# EAGLE design lnrc_basico_edu (EAGLE 7.1.0)
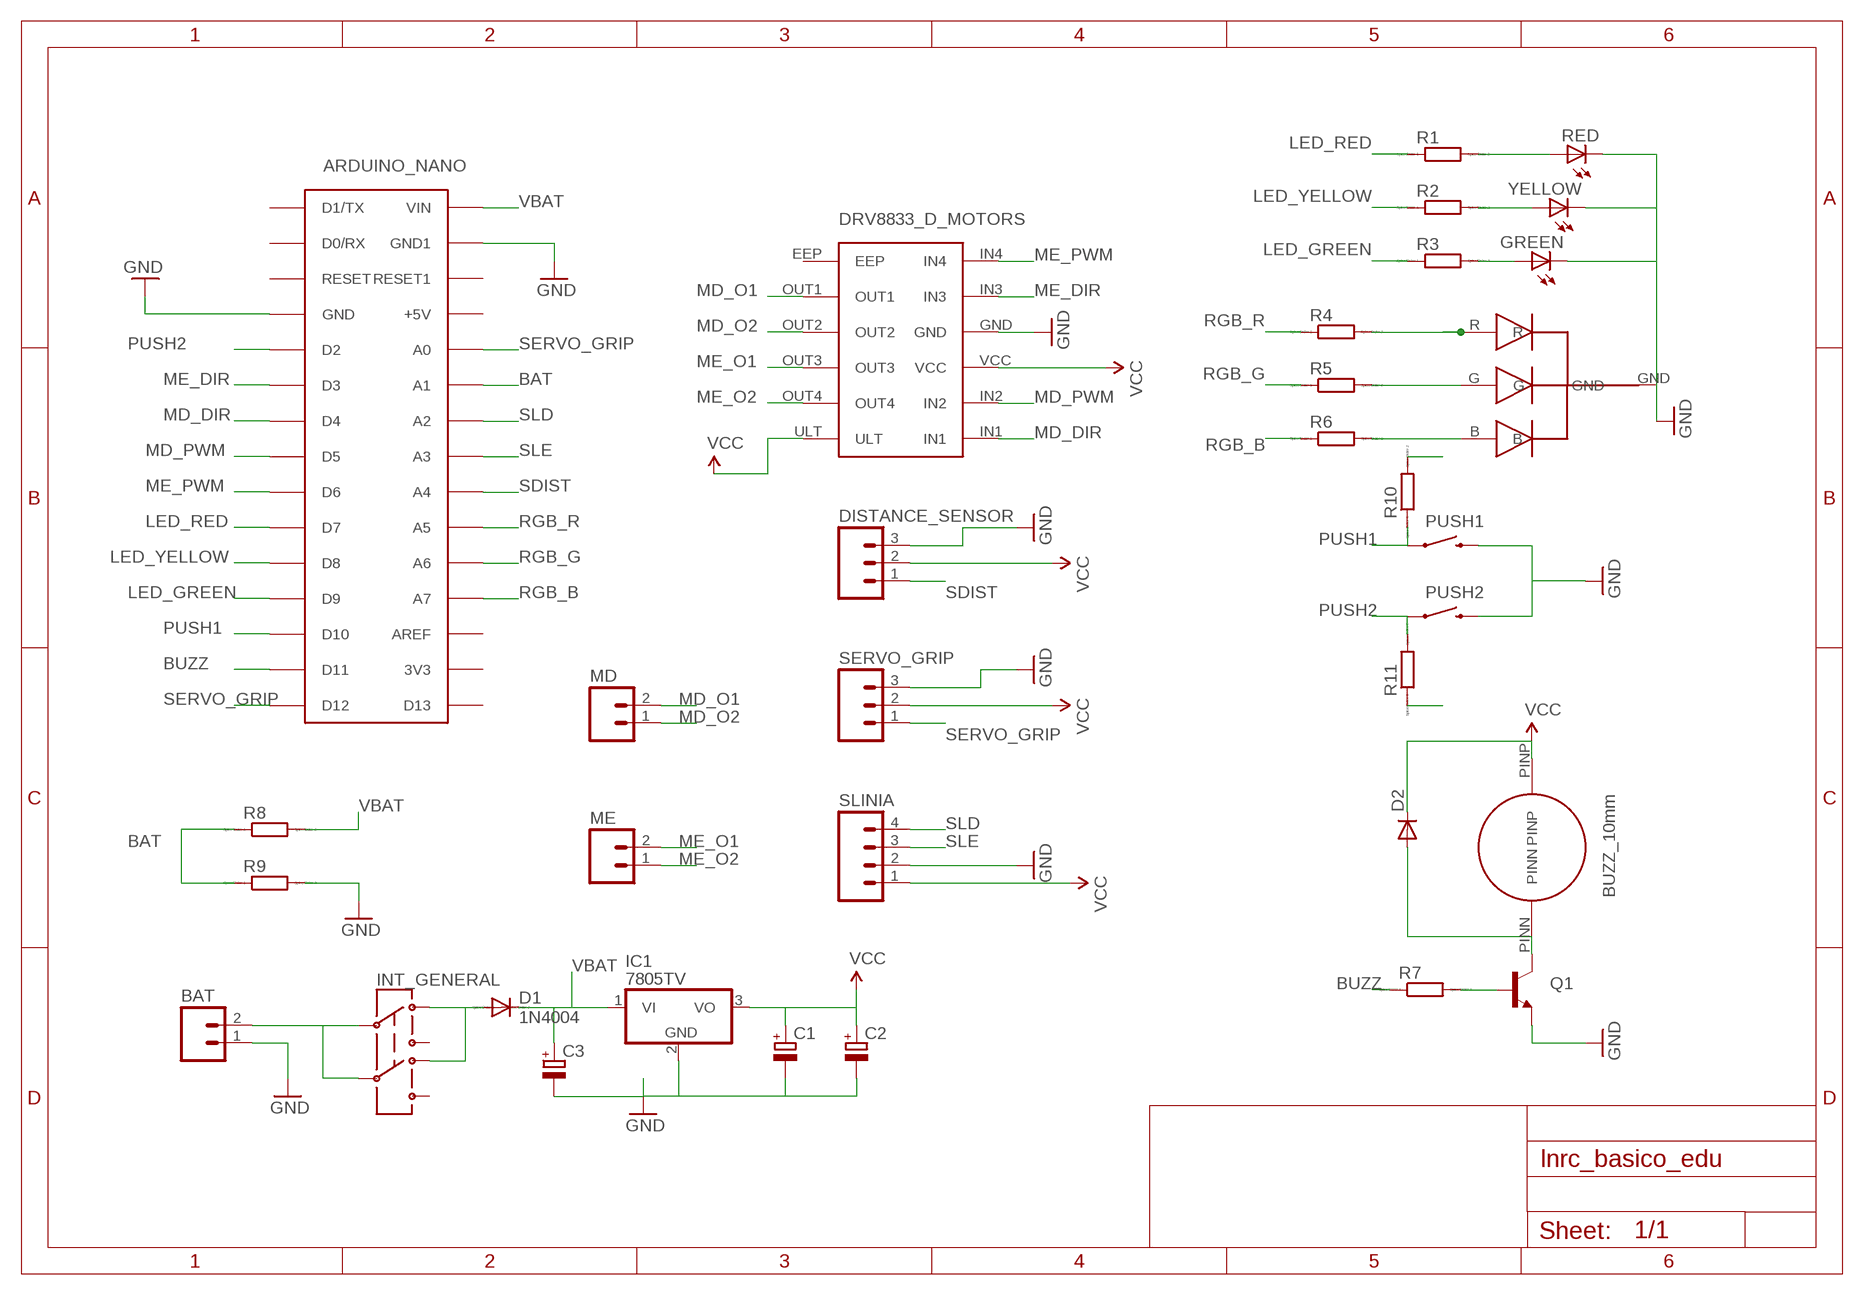
[diagram p0: schematic, sheet 1]

## Parts
ARDUINO_NANO  ARDUINONANO  [PDIP-32]
BAT  M02LOCK_LONGPADS  [1X02_LOCK_LONGPADS]
C1  CPOL-EUE2.5-6  [E2,5-6]
C2  CPOL-EUE2.5-6  [E2,5-6]
C3  CPOL-EUE2.5-6  [E2,5-6]
D1  1N4004  [DO41-10]
D2  DIODE1N4148  [DIODE-1N4148]
DISTANCE_SENSOR  M03LONGPADS  [1X03_LONGPADS]
DRV8833_D_MOTORS  DRV8833_BREAKOUT  [DRV8833_BREAKOUT]
GREEN  LED3MM  [LED3MM]
IC1  7805TV  [TO220V]
INT_GENERAL  AYZ0202_TH  [AYZ0202_TH]
MD  M02  [02P]
ME  M02  [02P]
PUSH1  SWITCH-MOMENTARY-2PTH  [TACTILE-PTH]
PUSH2  SWITCH-MOMENTARY-2PTH  [TACTILE-PTH]
Q1  TRANSISTOR_NPNBC547  [TO-92-AMMO]
R1  R-EU_0309_10  [0309/10]
R2  R-EU_0309_10  [0309/10]
R3  R-EU_0309_10  [0309/10]
R4  R-EU_0309_10  [0309/10]
R5  R-EU_0309_10  [0309/10]
R6  R-EU_0309_10  [0309/10]
R7  R-EU_0309_10  [0309/10]
R8  R-EU_0309_10  [0309/10]
R9  R-EU_0309_10  [0309/10]
R10  R-EU_0309_10  [0309/10]
R11  R-EU_0309_10  [0309/10]
RED  LED3MM  [LED3MM]
SERVO_GRIP  M03LONGPADS  [1X03_LONGPADS]
SLINIA  M04LONGPADS  [1X04_LONGPADS]
U$1  BUZZ_10MM  [BUZZ_10MM]
U$2  LED_RGB_COMCATH  [LED_RGB_COMMCATH]
YELLOW  LED3MM  [LED3MM]

## Nets
BAT: ARDUINO_NANO.A1 R8.1 R9.1
BUZZ: ARDUINO_NANO.D11 R7.1
GND: ARDUINO_NANO.GND ARDUINO_NANO.GND1 BAT.1 C1.- C2.- C3.- DISTANCE_SENSOR.3 DRV8833_D_MOTORS.GND GREEN.K(C) IC1.2(GND) PUSH1.3 PUSH2.3 Q1.3(E) R9.2 RED.K(C) SERVO_GRIP.3 SLINIA.2 U$2.GND YELLOW.K(C)
LED_GREEN: ARDUINO_NANO.D9 R3.1
LED_RED: ARDUINO_NANO.D7 R1.1
LED_YELLOW: ARDUINO_NANO.D8 R2.1
MD_DIR: ARDUINO_NANO.D4 DRV8833_D_MOTORS.IN1
MD_O1: DRV8833_D_MOTORS.OUT1 MD.2
MD_O2: DRV8833_D_MOTORS.OUT2 MD.1
MD_PWM: ARDUINO_NANO.D5 DRV8833_D_MOTORS.IN2
ME_DIR: ARDUINO_NANO.D3 DRV8833_D_MOTORS.IN3
ME_O1: DRV8833_D_MOTORS.OUT3 ME.2
ME_O2: DRV8833_D_MOTORS.OUT4 ME.1
ME_PWM: ARDUINO_NANO.D6 DRV8833_D_MOTORS.IN4
N$1: BAT.2 INT_GENERAL.C1 INT_GENERAL.C2
N$2: D1.A INT_GENERAL.D1 INT_GENERAL.D2
N$3: R1.2 RED.A
N$4: R2.2 YELLOW.A
N$5: GREEN.A R3.2
N$6: R4.2 U$2.R
N$7: R5.2 U$2.G
N$8: R6.2 U$2.B
N$11: Q1.2(B) R7.2
N$12: D2.A Q1.1(C) U$1.PINN
PUSH1: ARDUINO_NANO.D10 PUSH1.1 R10.1
PUSH2: ARDUINO_NANO.D2 PUSH2.1 R11.2
RGB_B: ARDUINO_NANO.A7 R6.1
RGB_G: ARDUINO_NANO.A6 R5.1
RGB_R: ARDUINO_NANO.A5 R4.1
SDIST: ARDUINO_NANO.A4 DISTANCE_SENSOR.1
SERVO_GRIP: ARDUINO_NANO.A0 ARDUINO_NANO.D12 SERVO_GRIP.1
SLD: ARDUINO_NANO.A2 SLINIA.4
SLE: ARDUINO_NANO.A3 SLINIA.3
VBAT: ARDUINO_NANO.VIN C3.+ D1.C IC1.1(VI) R8.2
VCC: C1.+ C2.+ D2.C DISTANCE_SENSOR.2 DRV8833_D_MOTORS.ULT DRV8833_D_MOTORS.VCC IC1.3(VO) R10.2 R11.1 SERVO_GRIP.2 SLINIA.1 U$1.PINP
Unconnected: ARDUINO_NANO.3V3 ARDUINO_NANO.+5V ARDUINO_NANO.AREF ARDUINO_NANO.D0/RX ARDUINO_NANO.D1/TX ARDUINO_NANO.D13 ARDUINO_NANO.RESET ARDUINO_NANO.RESET1 DRV8833_D_MOTORS.EEP INT_GENERAL.B1 INT_GENERAL.B2

## Notes on the sheet
- ARDUINO_NANO

## Library data of the parts
ARDUINO_NANO = jet-lib:ARDUINONANO
BAT = SparkFun:M02: Header 2 Standard 2-pin 0.1" header. Use with straight break away headers (SKU : PRT-00116), right angle break away headers (PRT-00553), swiss pins (PRT-00743), machine pins (PRT-00117), and female headers (PRT-00115). Molex polarized connector foot print use with SKU : PRT-08233 with associated crimp pins and housings.
C1-C3 = rcl:CPOL-EU: POLARIZED CAPACITOR, European symbol
D1 = diode:1N4004: DIODE general purpose rectifier, 1 A
D2 = SparkFun:DIODE: Diode These are standard reverse protection diodes and small signal diodes. SMA package can handle up to about 1A. SOD-323 can handle about 200mA. What the SOD-323 package when ordering, there are some mfgs out there that are 5-pin packages.
DISTANCE_SENSOR SERVO_GRIP = SparkFun:M03: Header 3 Standard 3-pin 0.1" header. Use with straight break away headers (SKU : PRT-00116), right angle break away headers (PRT-00553), swiss pins (PRT-00743), machine pins (PRT-00117), and female headers (PRT-00115). Molex polarized connector foot print use with SKU : PRT-08232 with associated crimp pins and housings.
DRV8833_D_MOTORS = drv8833-breakout:DRV8833_BREAKOUT
GREEN RED YELLOW = SparkFun:LED: LEDs Standard schematic elements and footprints for 5mm, 3mm, 1206, and 0603 sized LEDs. 5mm - Spark Fun Electronics SKU : COM-00529 (and others)
IC1 = linear:78*: Positive VOLTAGE REGULATOR Source: http://cache.national.com/ds/LM/LM78L05.pdf http://www.fairchildsemi.com/ds/LM/LM7805.pdf
INT_GENERAL = 1r_BAT_guissona:AYZ0202_TH
MD ME = con-amp-quick:M02: AMP QUICK CONNECTOR; OC_FARNELL: unknown; OC_NEWARK: unknown
PUSH1 PUSH2 = SparkFun-Electromechanical:SWITCH-MOMENTARY-2: Various NO switches- pushbuttons, reed, etc
Q1 = SparkFun-DiscreteSemi:TRANSISTOR_NPN: Generic NPN BJT MMBT2222A - TRANS-08049 (SOT-23, 1A 40V) MPSA42 - TRANS-09116 (SOT-23, 500mA 300V) MMBT5088LT1G - TRANS-11160 (SOT-23, 50 mA 30V) BC547 - COM-08928 <http://www.sparkfun.com/products/8928> (TO-92 45V 100mA) (1.Collector 2.Base 3.Emitter) 2N3904 - COM-00521 <http://www.sparkfun.com/products/521> (TO-92 40V 200mA) (1.Emitter 2.Base 3.Collector) P2N2222A - COM-12852 <http://www.sparkfun.com/products/12852> (TO-92 40V 600mA) (1.Collector 2.Base 3.Emitter)
R1-R11 = resistor:R-EU_: RESISTOR, European symbol; SPICEPREFIX: R
SLINIA = SparkFun:M04: Header 4 Standard 4-pin 0.1" header. Use with straight break away headers (SKU : PRT-00116), right angle break away headers (PRT-00553), swiss pins (PRT-00743), machine pins (PRT-00117), and female headers (PRT-00115). Molex polarized connector foot print use with SKU : PRT-08231 with associated crimp pins and housings. 1MM SMD Version SKU: PRT-10208
U$1 = BUZZ_10mm:BUZZ_10MM
U$2 = led_RGB:LED_RGB_COMCATH

## Board
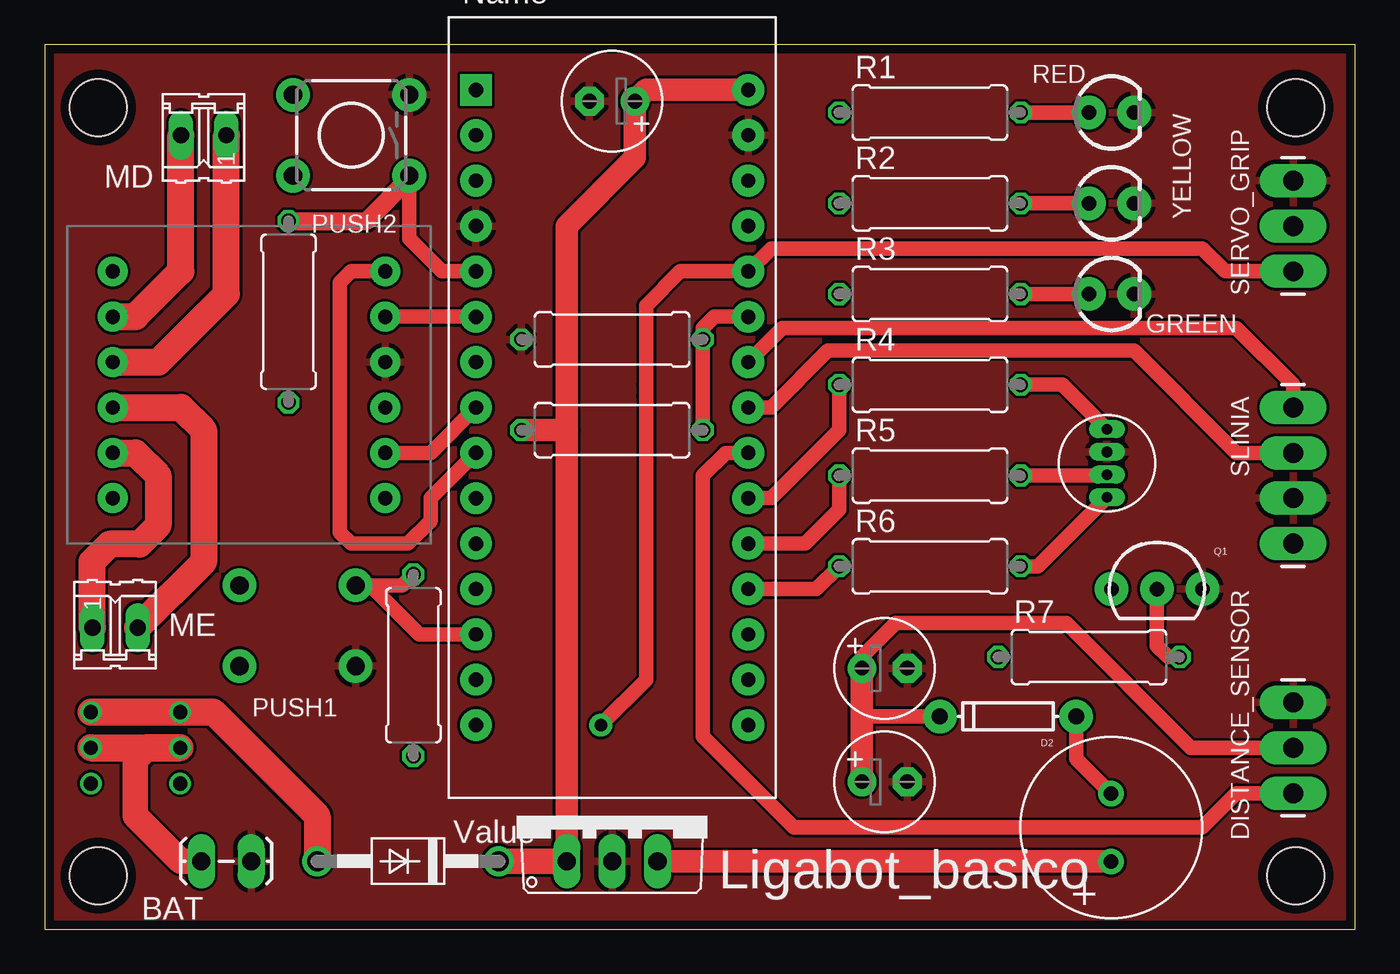
[diagram p1: board, top side]
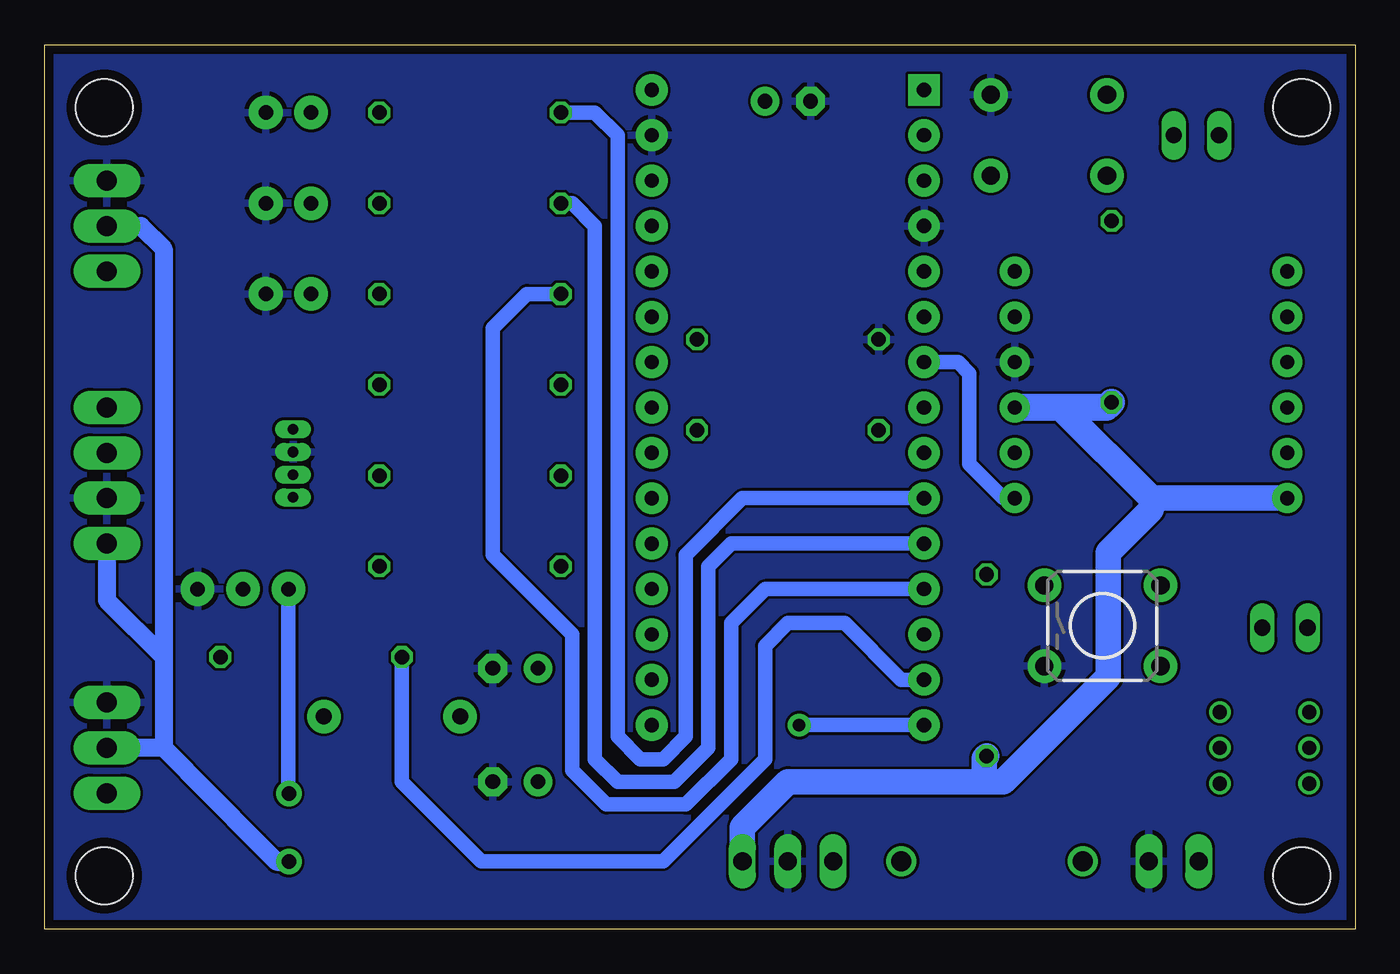
[diagram p2: board, bottom side, seen from below]

Size 73.33 x 49.52 mm. Coordinates in mm from the lower left corner, seen from the top.
Outline: 0,0 73.33,0 73.33,49.52 0,49.52 0,0
Copper layers (1*16): Top 0.035mm / dielectric 1.6mm / Bottom 0.035mm
Design rules "Elecrow_2-layer_PCB_eagle_rule": minimum track width 6mil, minimum drill 12mil, track to track 6mil, track to pad 6mil, pad to pad 6mil, via to via 8mil, smd to smd 0mil, copper to edge 20mil, drill to drill 10mil, minimum pad ring 6mil, minimum via ring 6mil, stop-mask expansion 0mil, vias tented up to drill 100mil, thermal gap 10mil
Holes 3.2 mm at 3,46 70,46 70,3 3,3

### Footprints (pad centres in the part's own frame; a part is rotated, then mirrored left to right if it is on the bottom)
PDIP-32 = drill 0.8 pad 1.778: 3V3 15.24,-35.56; +5V 15.24,-10.16; A0 15.24,-12.7; A1 15.24,-15.24; A2 15.24,-17.78; A3 15.24,-20.32; A4 15.24,-22.86; A5 15.24,-25.4; A6 15.24,-27.94; A7 15.24,-30.48; AREF 15.24,-33.02; D0/RX 0,-5.08; D2 0,-12.7; D3 0,-15.24; D4 0,-17.78; D5 0,-20.32; D6 0,-22.86; D7 0,-25.4; D8 0,-27.94; D9 0,-30.48; D10 0,-33.02; D11 0,-35.56; D12 0,-38.1; D13 15.24,-38.1; GND 0,-10.16; GND1 15.24,-5.08; RESET 0,-7.62; RESET1 15.24,-7.62; VIN 15.24,-2.54 | drill 0.8 pad 1.778 square: D1/TX 0,-2.54
1X02_LOCK_LONGPADS = drill 1.016 long: 1 -0.127,0; 2 2.667,0
E2,5-6 = drill 0.813 pad 1.6: + -1.27,0 | drill 0.813 pad 1.6 octagon: - 1.27,0
DO41-10 = drill 1.118: A 5.08,0; C -5.08,0
DIODE-1N4148 = drill 0.9 pad 1.88: A -3.81,0; C 3.81,0
1X03_LONGPADS = drill 1.118 pad 1.88 long: 1 0,0; 2 2.54,0; 3 5.08,0
DRV8833_BREAKOUT = drill 0.8 pad 1.676: EEP 0,7.62; GND 15.24,2.54; IN1 15.24,-5.08; IN2 15.24,-2.54; IN3 15.24,5.08; IN4 15.24,7.62; OUT1 0,5.08; OUT2 0,2.54; OUT3 0,0; OUT4 0,-2.54; ULT 0,-5.08; VCC 15.24,0
LED3MM = drill 0.813 pad 1.88: A -1.27,0; K 1.27,0
TO220V = drill 1.016 long: 1 -2.54,-2.54; 2 0,-2.54; 3 2.54,-2.54
AYZ0202_TH = drill 0.8: B1 -2.5,-2; B2 2.5,-2; C1 -2.5,0; C2 2.5,0; D1 -2.5,2; D2 2.5,2
02P = drill 0.914 long: 1 -1.27,0; 2 1.27,0
TACTILE-PTH = drill 1.016 pad 1.88: 1 -3.251,2.261; 2 3.251,2.261; 3 -3.251,-2.261; 4 3.251,-2.261
TO-92-AMMO = drill 0.813 pad 1.88: 1 -2.54,0; 2 0,0; 3 2.54,0
0309/10 = drill 0.813 octagon: 1 -5.08,0; 2 5.08,0
1X04_LONGPADS = drill 1.118 pad 1.88 long: 1 0,0; 2 2.54,0; 3 5.08,0; 4 7.62,0
BUZZ_10MM = drill 0.8 pad 1.422: PINN 3.81,0; PINP 0,0
LED_RGB_COMMCATH = drill 0.6 pad 1.016 long: B 0,2.54; G 0,1.27; GND 0,0; R 0,-1.27

### Placement (x,y rotation side)
ARDUINO_NANO  24.13,49.53 0 top
BAT  11.43,3.81 180 top
C1  46.99,8.26 0 top
C2  46.99,14.61 0 top
C3  31.75,46.35 180 top
D1  20.32,3.81 180 top
D2  53.9,11.91 180 top
DISTANCE_SENSOR  69.85,7.62 90 top
DRV8833_D_MOTORS  3.81,29.21 0 top
GREEN  59.69,35.56 0 top
IC1  31.75,6.35 0 top
INT_GENERAL  5.08,10.16 0 top
MD  8.89,44.45 180 top
ME  3.94,16.89 0 top
PUSH1  14.15,16.99 0 bottom
PUSH2  17.14,44.45 180 top
Q1  62.23,19.05 0 top
R1  49.53,45.72 0 top
R2  49.53,40.64 0 top
R3  49.53,35.56 0 top
R4  49.53,30.48 0 top
R5  49.53,25.4 0 top
R6  49.53,20.32 0 top
R7  58.42,15.24 0 top
R8  31.75,27.94 180 top
R9  31.75,33.02 180 top
R10  20.62,14.78 270 top
R11  13.64,34.57 90 top
RED  59.69,45.72 0 top
SERVO_GRIP  69.85,36.83 90 top
SLINIA  69.85,21.59 90 top
U$1  59.66,3.78 90 top
U$2  59.44,26.72 180 top
YELLOW  59.69,40.64 0 top

### Tracks (layer width: path | path; a pad name or v marks a point on that pad's centre or on a via)
BAT
  Top 0.813: R8.1 R9.1 36.83,33.66 37.47,34.29 ARDUINO_NANO.A1
BUZZ
  Bottom 0.813: ARDUINO_NANO.D11 25.4,13.97 28.57,17.14 31.75,17.14 33.02,15.88 33.02,9.53 38.73,3.81 48.9,3.81 53.34,8.26 R7.1
GND
  pour Bottom: 0,0 73.33,0 73.33,49.5 0,49.5
  pour Top: 0,0 73.33,0 73.33,49.53 0,49.53
LED_GREEN
  Bottom 0.813: ARDUINO_NANO.D9 33.02,19.05 34.92,17.14 34.92,9.53 37.47,6.99 41.91,6.99 43.81,8.89 43.81,16.51 48.26,20.95 48.26,33.66 46.35,35.56 R3.1
LED_RED
  Bottom 0.813: ARDUINO_NANO.D7 34.29,24.13 37.47,20.95 37.47,10.79 38.73,9.53 40.01,9.53 41.27,10.79 41.27,44.45 42.55,45.72 R1.1
LED_YELLOW
  Bottom 0.813: R2.1 43.81,40.64 42.55,39.37 42.55,9.53 41.27,8.26 38.1,8.26 36.2,10.16 36.2,20.32 34.92,21.59 ARDUINO_NANO.D8
MD_DIR
  Bottom 0.813: DRV8833_D_MOTORS.IN1 19.68,24.13 21.59,26.04 21.59,31.11 22.23,31.75 ARDUINO_NANO.D4
MD_O1
  Top 1.524: DRV8833_D_MOTORS.OUT1 5.08,34.29 7.62,36.83 MD.2
MD_O2
  Top 1.524: DRV8833_D_MOTORS.OUT2 6.35,31.75 10.16,35.56 MD.1
MD_PWM
  Top 0.813: DRV8833_D_MOTORS.IN2 21.59,26.67 ARDUINO_NANO.D5
ME_DIR
  Top 0.813: DRV8833_D_MOTORS.IN3 ARDUINO_NANO.D3
ME_O1
  Top 1.524: DRV8833_D_MOTORS.OUT3 7.62,29.21 8.89,27.94 8.89,20.57 ME.2
ME_O2
  Top 1.524: DRV8833_D_MOTORS.OUT4 5.08,26.67 6.35,25.4 6.35,22.61 5.31,21.57 3.63,21.57 2.64,20.57 2.64,16.92 ME.1
ME_PWM
  Top 0.813: DRV8833_D_MOTORS.IN4 17.14,36.83 16.51,36.2 16.51,22.23 17.14,21.59 20.32,21.59 21.59,22.86 21.59,24.13 ARDUINO_NANO.D6
N$1
  Top 1.422: BAT.2 7.62,3.81 5.08,6.35 5.08,9.53
  Top 1.524: INT_GENERAL.C1 INT_GENERAL.C2 5.71,10.16 5.08,9.53
N$2
  Top 1.524: INT_GENERAL.D1 INT_GENERAL.D2 9.43,12.16 15.24,6.35 D1.A
N$3
  Top 0.813: R1.2 RED.A
N$4
  Top 0.813: R2.2 YELLOW.A
N$5
  Top 0.813: R3.2 GREEN.A
N$6
  Top 0.813: R4.2 56.95,30.48 U$2.R
N$7
  Top 0.813: R5.2 59.38,25.4 U$2.G
N$8
  Top 0.813: R6.2 55.58,20.32 U$2.B
N$11
  Top 0.813: R7.2 62.87,15.24 62.23,15.88 Q1.2
N$12
  Top 0.813: D2.A 57.71,9.55 U$1.PINN
  Bottom 0.813: Q1.1 59.69,7.62 U$1.PINN
PUSH1
  Top 0.813: ARDUINO_NANO.D10 20.95,16.51 18.21,19.25 | 18.21,19.25 18.06,19.25 PUSH1.1 | R10.1 20.02,19.25 18.21,19.25
PUSH2
  Top 0.813: PUSH2.1 20.4,38.66 22.23,36.83 ARDUINO_NANO.D2
  Top 1.016: R11.2 18.01,39.65 20.4,42.04 PUSH2.1
RGB_B
  Top 0.813: ARDUINO_NANO.A7 43.18,19.05 R6.1
RGB_G
  Top 0.813: ARDUINO_NANO.A6 42.55,21.59 44.45,23.5 R5.1
RGB_R
  Top 0.813: ARDUINO_NANO.A5 40.64,24.13 44.45,27.94 R4.1
SDIST
  Top 0.813: ARDUINO_NANO.A4 38.1,26.67 36.83,25.4 36.83,10.79 41.91,5.71 64.77,5.71 66.67,7.62 DISTANCE_SENSOR.1
SERVO_GRIP  (via drill 0.7 pad 1.27)
  Top 0.813: SERVO_GRIP.1 66.04,36.83 64.77,38.1 40.64,38.1 ARDUINO_NANO.A0 35.56,36.83 33.66,34.92 33.66,30.48 33.66,29.84 33.66,13.97 v31.11,11.43
  Bottom 0.813: v31.11,11.43 ARDUINO_NANO.D12
SLD
  Top 0.813: SLINIA.4 69.85,30.48 66.67,33.66 41.27,33.66 ARDUINO_NANO.A2
SLE
  Top 0.813: ARDUINO_NANO.A3 40.64,29.21 43.81,32.38 60.96,32.38 66.67,26.67 SLINIA.3
VBAT
  Top 1.27: ARDUINO_NANO.VIN 33.66,46.99 C3.+ 33.02,43.18 29.21,39.37 29.21,27.94 | IC1.1 29.21,27.94 | R8.2 29.21,27.94
  Top 1.422: D1.C IC1.1
VCC
  Top 0.813: DISTANCE_SENSOR.2 64.14,10.16 57.15,17.14 47.62,17.14 45.72,15.24 C2.+ | D2.C 45.87,11.91 45.72,12.06
  Top 1.27: IC1.3 59.66,3.81 U$1.PINP | C1.+ 45.72,12.06 C2.+
  Bottom 1.016: 66.67,10.16 61.44,4.88 60.35,3.79 U$1.PINP | 66.67,10.16 DISTANCE_SENSOR.2 | SLINIA.1 69.85,18.41 66.67,15.24 | 66.67,15.24 66.67,10.16 | SERVO_GRIP.2 67.94,39.37 66.67,38.1 66.67,15.24
  Bottom 1.422: DRV8833_D_MOTORS.ULT 11.43,24.13 | 11.43,24.13 16.51,29.21 DRV8833_D_MOTORS.VCC | 20.75,8.26 31.75,8.26 34.29,5.71 IC1.3 | 20.75,8.26 19.68,8.26 13.82,14.12 13.82,21.11 11.43,23.5 11.43,24.13 | R10.2 20.75,9.58 20.75,8.26
  Bottom 1.524: R11.1 13.92,29.21 DRV8833_D_MOTORS.VCC

### Text on the board
tNames: Ligabot_basico